# EAGLE design perimeter_sensor (EAGLE 6.5.0)
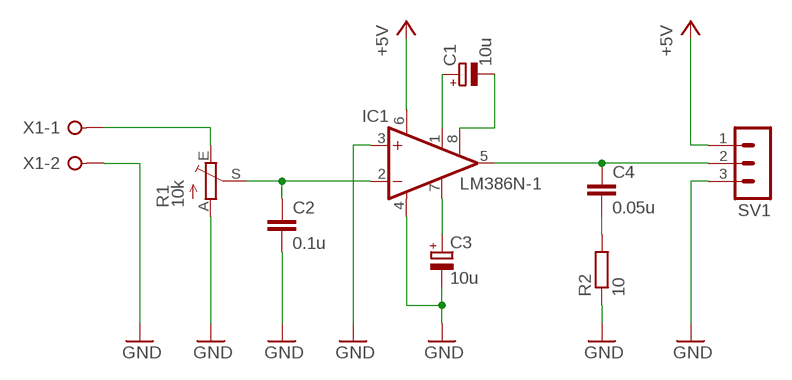
[diagram p0: schematic, sheet 1]

## Parts
C1  10u  CPOL-EUE2.5-6  [E2,5-6]
C2  0.1u  C-EU050-025X075  [C050-025X075]
C3  10u  CPOL-EUE2.5-6  [E2,5-6]
C4  0.05u  C-EU050-025X075  [C050-025X075]
IC1  LM386N-1  [DIL08]
R1  10k  TRIM_EU-S64W  [S64W]
R2  10  R-EU_0204/7  [0204/7]
SV1  MA03-1  [MA03-1]
X1  W237-02P  [W237-132]

## Nets
+5V: IC1.6(VS) SV1.1
GND: C2.2 C3.- IC1.3(+IN) IC1.4(GND) R1.A R2.1 SV1.3 X1.2
N$1: C1.- IC1.8(GAIN)
N$2: C1.+ IC1.1(GAIN)
N$3: C3.+ IC1.7(BYPASS)
N$4: C2.1 IC1.2(-IN) R1.S
N$5: C4.1 IC1.5(OUT) SV1.2
N$6: C4.2 R2.2
N$7: R1.E X1.1

## Library data of the parts
C1 C3 = rcl:CPOL-EU: POLARIZED CAPACITOR, European symbol
C2 C4 = rcl:C-EU: CAPACITOR, European symbol
IC1 = linear:LM386?-*: Low Voltage Audio Power Amplifier Source: http://cache.national.com/ds/LM/LM386.pdf
R1 = pot:TRIM_EU-: POTENTIOMETER
R2 = rcl:R-EU_: RESISTOR, European symbol
SV1 = con-lstb:MA03-1: PIN HEADER; OC_FARNELL: unknown; OC_NEWARK: unknown
X1 = con-wago-508:W237-02P: WAGO SREW CLAMP; OC_FARNELL: unknown; OC_NEWARK: unknown

## Board
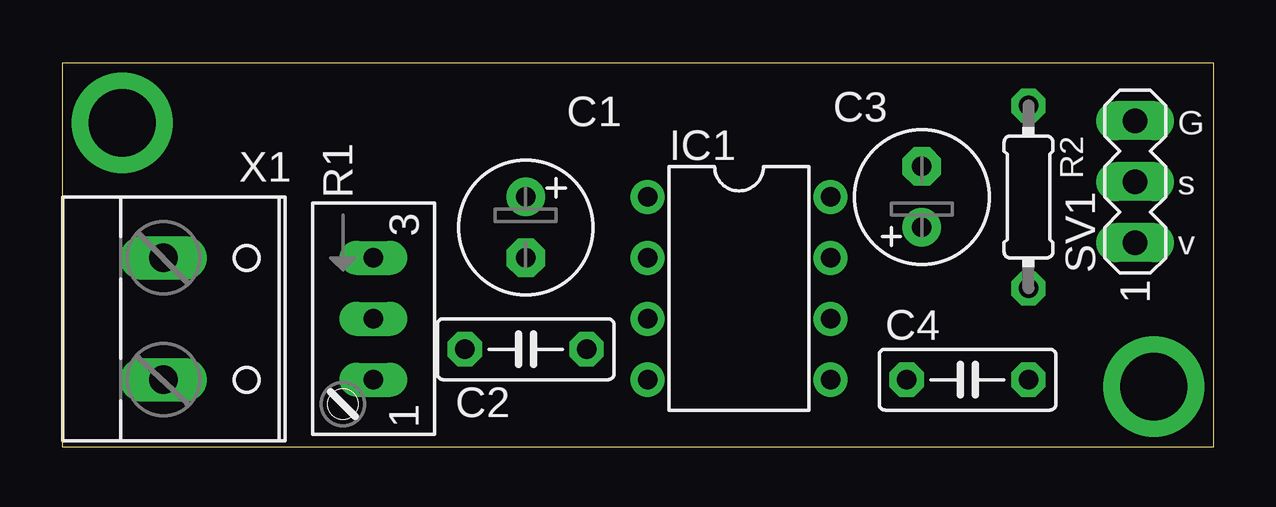
[diagram p1: board, top side]
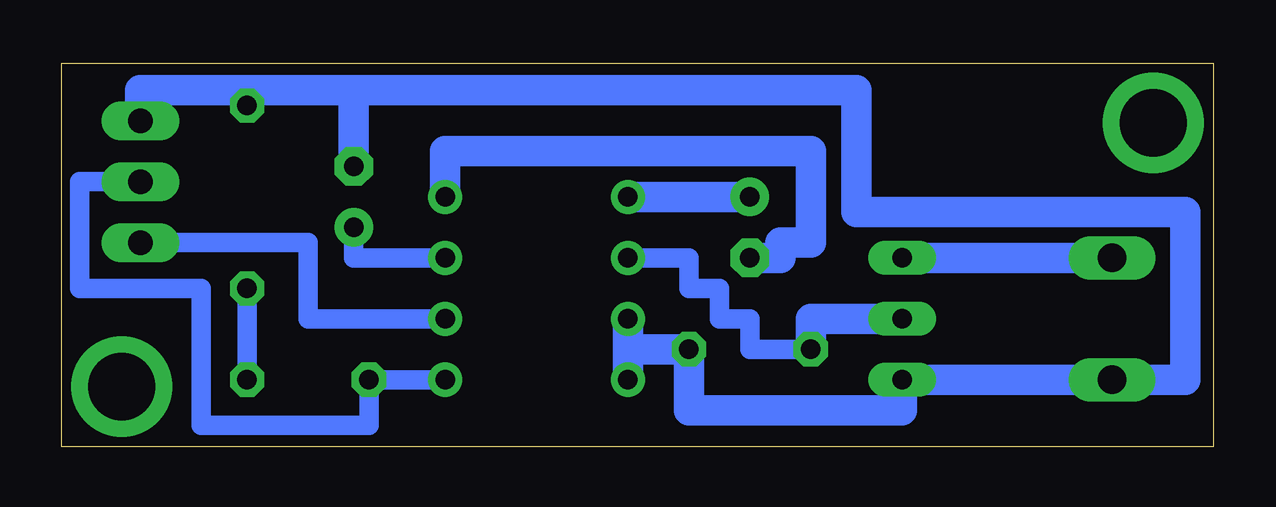
[diagram p2: board, bottom side, seen from below]

Size 48 x 16 mm. Coordinates in mm from the lower left corner, seen from the top.
Outline: 0,0 48,0 48,16 0,16 0,0
Copper layers (1*16): Top 0.035mm / dielectric 1.5mm / Bottom 0.035mm
Design rules "default": minimum track width 20mil, minimum drill 32mil, track to track 12mil, track to pad 12mil, pad to pad 12mil, via to via 12mil, smd to smd 8mil, copper to edge 40mil, drill to drill 40mil, minimum pad ring 12mil, minimum via ring 12mil, stop-mask expansion 4mil, vias tented up to drill 0mil, thermal gap 10mil

### Footprints (pad centres in the part's own frame; a part is rotated, then mirrored left to right if it is on the bottom)
E2,5-6 = drill 0.813 pad 1.6: + -1.27,0 | drill 0.813 pad 1.6 octagon: - 1.27,0
C050-025X075 = drill 0.813 octagon: 1 -2.54,0; 2 2.54,0
DIL08 = drill 0.813 pad 1.27: 1 -3.81,-3.81; 2 -1.27,-3.81; 3 1.27,-3.81; 4 3.81,-3.81; 5 3.81,3.81; 6 1.27,3.81; 7 -1.27,3.81; 8 -3.81,3.81
S64W = drill 0.813 long: A 2.54,1.27; E -2.54,1.27; S 0,1.27
0204/7 = drill 0.813 octagon: 1 -3.81,0; 2 3.81,0
MA03-1 = drill 1.016 long: 1 -2.54,0; 2 0,0; 3 2.54,0
W237-132 = drill 1.194 long: 1 -2.54,-0.635; 2 2.54,-0.635

### Placement (x,y rotation side)
C1  19.32,9.14 270 top
C2  19.32,4.06 0 top
C3  35.83,10.41 90 top
C4  37.73,2.79 0 top
IC1  28.21,6.6 270 top
R1  11.7,5.33 270 top
R2  40.27,10.41 270 top
SV1  44.72,11.05 90 top
X1  4.85,5.33 270 top

### Tracks (layer width: path | path; a pad name or v marks a point on that pad's centre or on a via)
+5V
  Bottom 0.813: SV1.1 37.73,8.51 37.73,5.33 IC1.6
GND
  Bottom 1.27: IC1.4 IC1.3 24.4,4.06 C2.2 21.86,1.52 12.97,1.52 R1.A X1.2 1.17,2.79 1.17,9.77 14.88,9.77 14.88,14.85 35.83,14.85 | SV1.3 44.72,14.85 40.27,14.85 | 40.27,14.85 35.83,14.85 | R2.1 40.27,14.85 | C3.- 35.83,14.85
N$1
  Bottom 1.27: C1.- 18.05,7.87 18.05,8.51 16.78,8.51 16.78,12.31 32.02,12.31 IC1.8
N$2
  Bottom 1.27: C1.+ IC1.1
N$3
  Bottom 0.813: C3.+ 35.83,7.87 IC1.7
N$4
  Bottom 0.813: C2.1 19.32,4.06 19.32,5.33 20.59,5.33 20.59,6.6 21.86,6.6 21.86,7.87 IC1.2
  Bottom 1.27: R1.S 16.78,5.33 C2.1
N$5
  Bottom 0.813: IC1.5 C4.1 35.2,0.88 42.18,0.88 42.18,6.6 47.26,6.6 47.26,11.05 SV1.2
N$6
  Bottom 0.813: R2.2 C4.2
N$7
  Bottom 1.27: X1.1 R1.E
N$8  (via drill 2.8 pad 1.27)
  other vias: 2.5,13.5 45.5,2.5

### Text on the board
tNames: G | s | v